# EasyEDA Pro project eLight_SD1006.eprj

# Schematic SCH
Create Date: 2023-01-14; Page Name: P1; Project Name: eLight_lite; Schematic Name: SCH; Update Date: 2023-02-21; Company: 嘉立创EDA; Page Size: A4; Version: V1.0
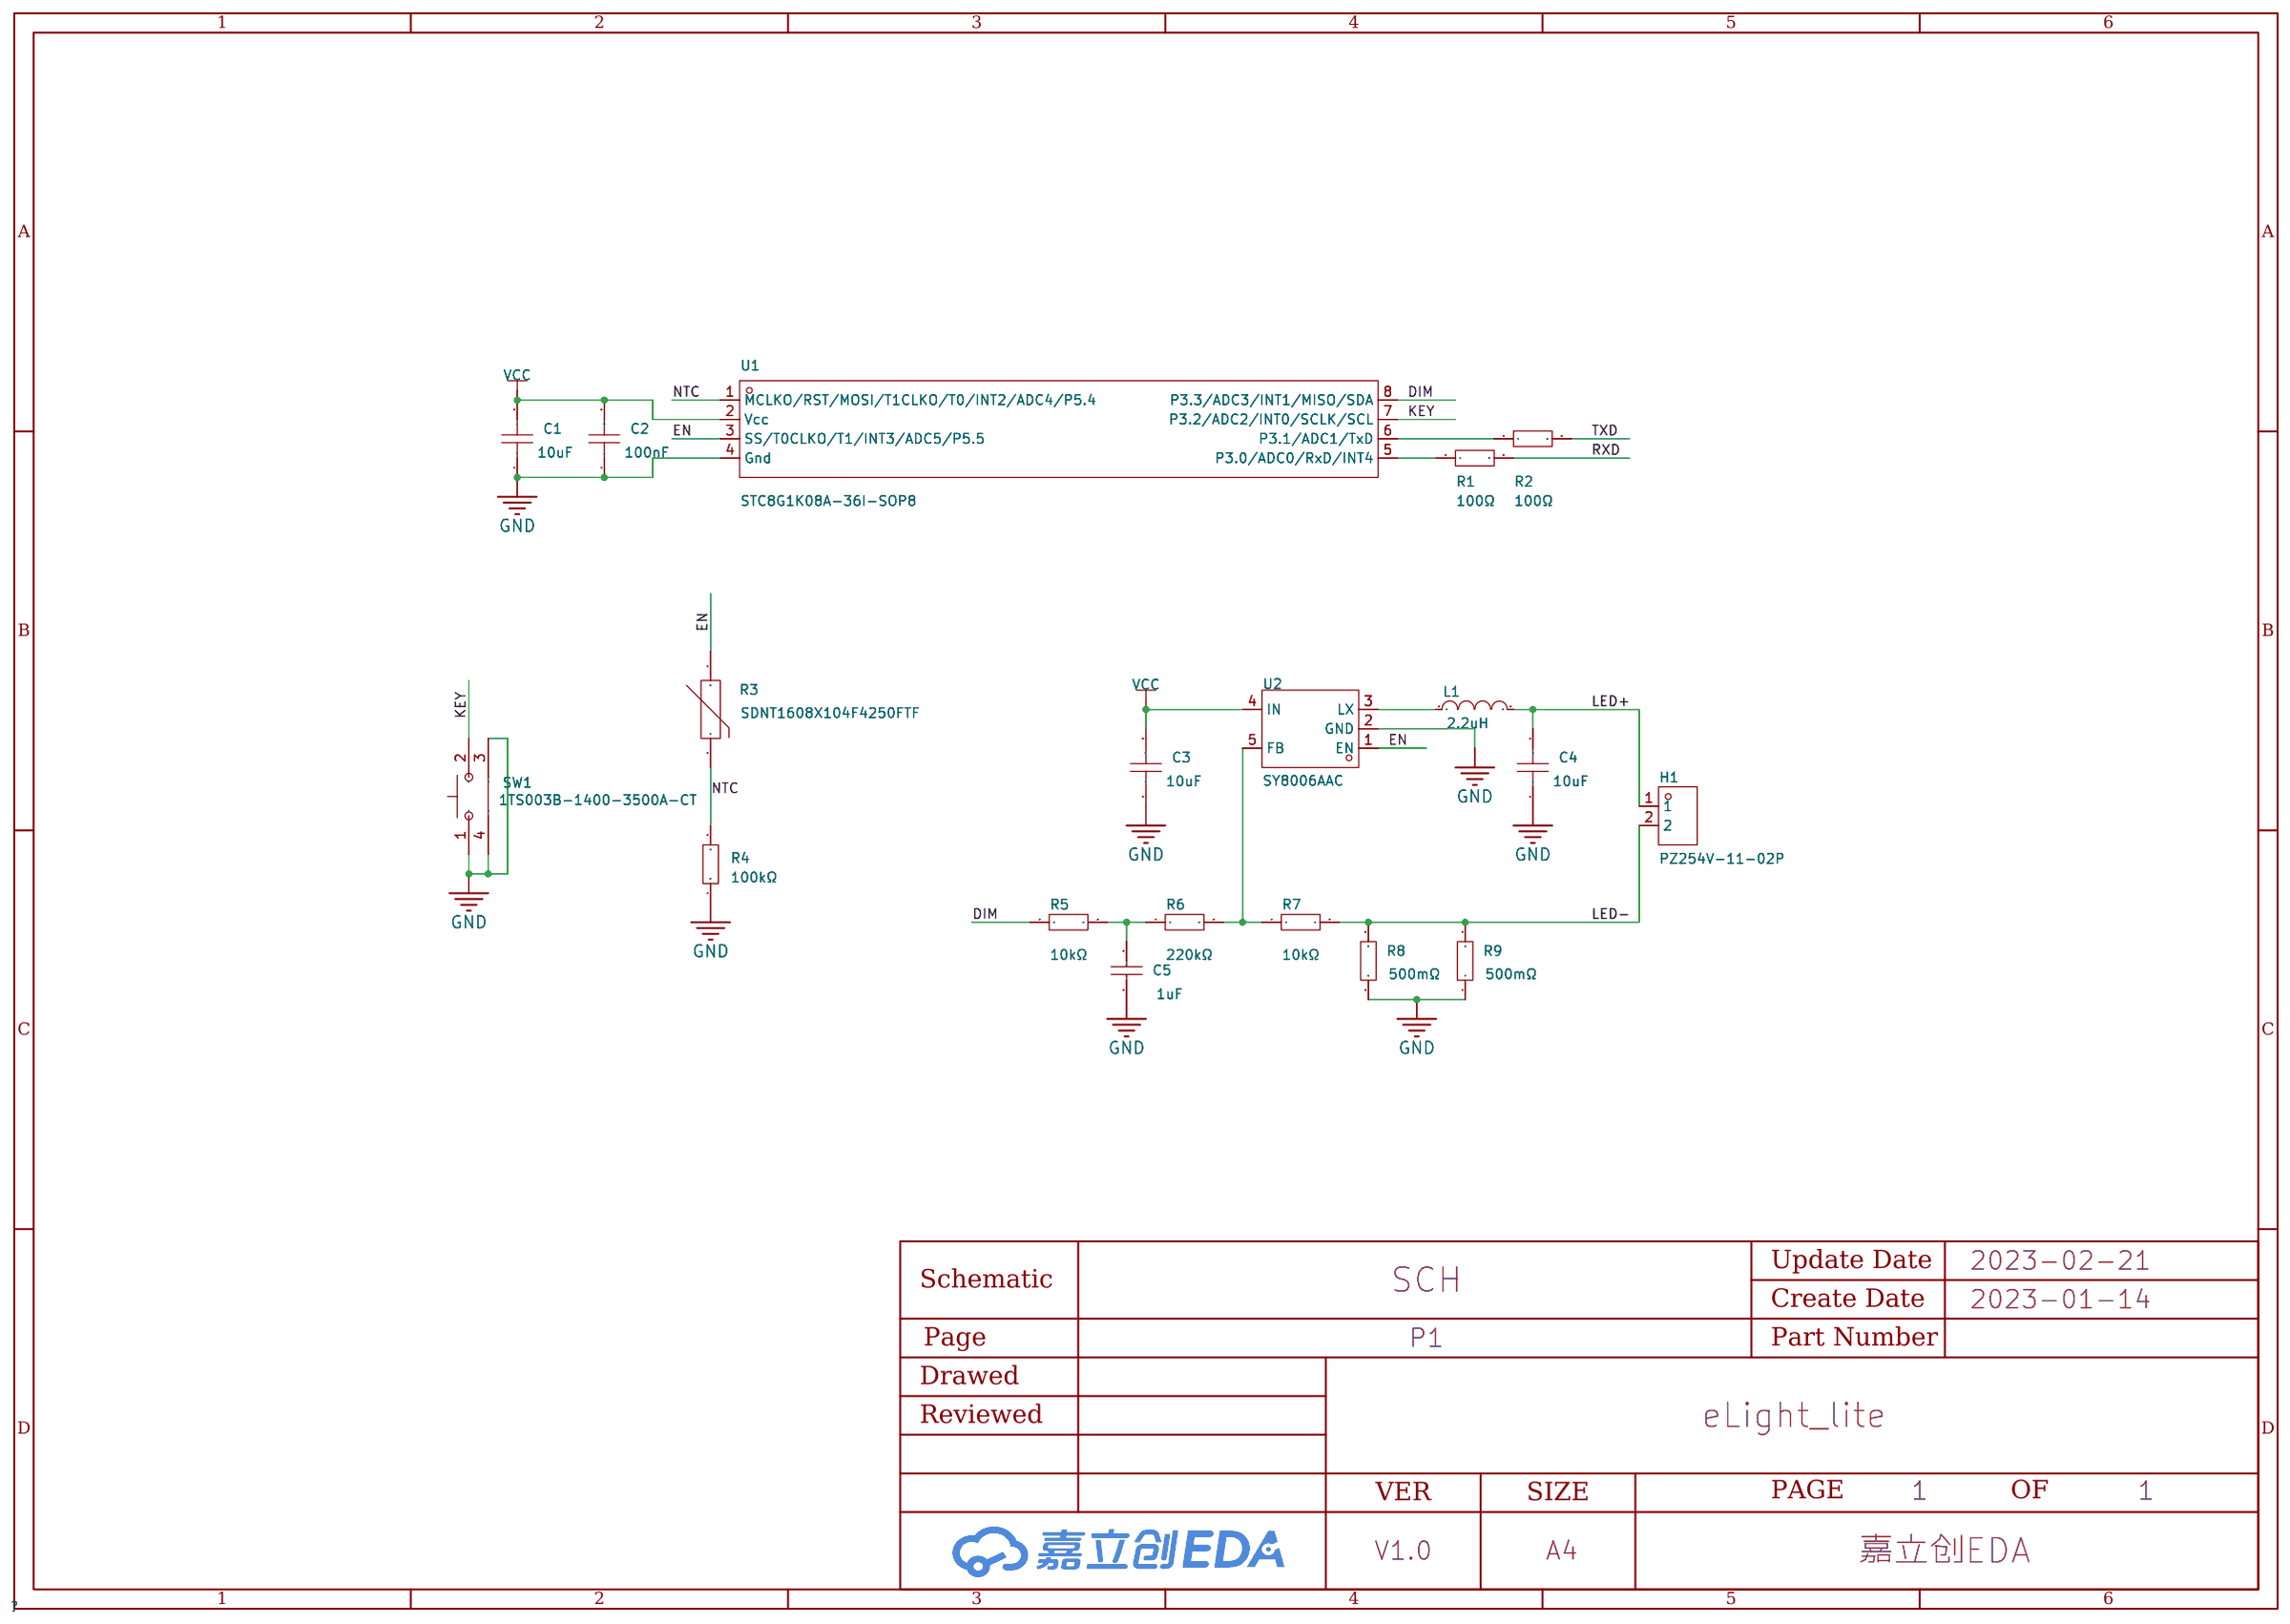
[diagram p0: schematic sheet]

## Parts
C1  10uF  [C0603]
C2  100nF  [C0603]
C3  10uF  [C0603]
C4  10uF  [C0603]
C5  1uF  [C0603]
H1  PZ254V-11-02P  [HDR-TH_2P-P2.54-V-M]  (no BOM)
L1  2.2uH  [IND-SMD_L4.0-W4.0]
R1  100Ω  [R0603]
R2  100Ω  [R0603]
R3  SDNT1608X104F4250FTF  [R0603]
R4  100kΩ  [R0603]
R5  10kΩ  [R0603]
R6  220kΩ  [R0603]
R7  10kΩ  [R0603]
R8  500mΩ  [R0805]
R9  500mΩ  [R0805]
SW1  1TS003B-1400-3500A-CT  [KEY-SMD_1TS003B]
U1  STC8G1K08A-36I-SOP8  [SOP-8_L5.0-W4.0-P1.27-LS6.0-BL]
U2  SY8006AAC  [SOT-23-5_L3.0-W1.6-P0.95-LS2.8-BR]

## Library data of the parts
C1 C3 C4 = CL10A106KP8NNNC: 容值:10uF;精度:±10%;额定电压:10V;材质(温度系数):X5R;; LCSC Part Name: 10uF ±10% 10V; Supplier Part: C19702; Manufacturer: SAMSUNG(三星); Supplier Footprint: 0603; JLCPCB Part Class: Basic Part; Datasheet: https://atta.szlcsc.com/upload/public/pdf/source/20160103/1457707703378.pdf; Supplier: LCSC; Tolerance: ±10%; Voltage Rated: 10V; Temperature Coefficient: X5R
C2 = CC0603KRX7R9BB104: 容值:100nF;精度:±10%;额定电压:50V;材质(温度系数):X7R;; LCSC Part Name: 100nF ±10% 50V; Supplier Part: C14663; Manufacturer: YAGEO(国巨); Supplier Footprint: 0603; JLCPCB Part Class: Basic Part; Datasheet: https://atta.szlcsc.com/upload/public/pdf/source/20170116/1484561234239.pdf; Supplier: LCSC; Tolerance: ±10%; Voltage Rated: 50V; Temperature Coefficient: X7R
C5 = CL10A105KB8NNNC: 容值:1uF;精度:±10%;额定电压:50V;材质(温度系数):X5R;; LCSC Part Name: 1uF ±10% 50V; Supplier Part: C15849; Manufacturer: SAMSUNG(三星); Supplier Footprint: 0603; JLCPCB Part Class: Basic Part; Datasheet: https://atta.szlcsc.com/upload/public/pdf/source/20160103/1457707679084.pdf; Supplier: LCSC; Tolerance: ±10%; Voltage Rated: 50V; Temperature Coefficient: X5R
H1 = PZ254V-11-02P: 排数:单排;总PIN位数:2;间距:2.54mm;插针结构:1x2P;行距:-;安装类型:直插;圆针/方针:方针;额定电流:-;额定电压:-;配合针长度:6mm;塑高:2.5mm;端接针长度:3mm;触头材质:黄铜;触头镀层:-;工作温度范围:-40℃~+105℃;颜色:黑色;; LCSC Part Name: 2.54mm 1x2P 直插 方针; Supplier Part: C492401; Manufacturer: XFCN(兴飞); Supplier Footprint: 直插,P=2.54mm; JLCPCB Part Class: Extended Part; Datasheet: https://atta.szlcsc.com/upload/public/pdf/source/20200309/C492401_A812433581A9B211A7FFA413ADDFF0E5.pdf; Supplier: LCSC; Number of Rows: 单排; Number of Pins: 2; Pitch: 2.54mm; Pin Structure: 1x2P; Mounting Type: 直插; Circluar Pins/Square Pins: 方针; Length of Mating Pin: 6mm; Insulation Height: 2.5mm; Length of End Connection Pin: 3mm; Contact Material: 黄铜; Operating Temperature Range: -40℃~+105℃; Color: 黑色
L1 = SWPA4020S2R2MT: 电感值:2.2uH;精度:±20%;额定电流:-;直流电阻(DCR):-;; LCSC Part Name: 2.2uH ±20%; Supplier Part: C83423; Manufacturer: Sunlord(顺络); Supplier Footprint: SMD; JLCPCB Part Class: Extended Part; Datasheet: https://atta.szlcsc.com/upload/public/pdf/source/20210916/AC798BA7E846B7D0B6818F45CD84DB0B.pdf; Supplier: LCSC; Tolerance: ±20%
R1 R2 = 0603WAF1000T5E: 电阻类型:厚膜电阻;阻值:100Ω;精度:±1%;功率:100mW;温度系数:±200ppm/℃;最大工作电压:75V;工作温度范围:-55℃~+155℃;; LCSC Part Name: 100Ω ±1% 100mW; Supplier Part: C22775; Manufacturer: UNI-ROYAL(厚声); Supplier Footprint: 0603; JLCPCB Part Class: Basic Part; Datasheet: https://atta.szlcsc.com/upload/public/pdf/source/20200306/C422600_1E6D84923E4A46A82E41ADD87F860B5C.pdf; Supplier: LCSC; Type: 厚膜电阻; Tolerance: ±1%; Power(Watts): 100mW; Temperature Coefficient: ±200ppm/℃; Overload Voltage (Max): 75V; Operating Temperature Range: -55℃~+155℃
R3 = SDNT1608X104F4250FTF: 阻值(25℃):100kΩ;电阻精度:±1%;B值精度:±1%;B值(25℃/50℃):4250K;功率:100mW;最大稳态电流(25℃):100uA;B值(25℃/75℃):-;B值(25℃/85℃):-;B值(25℃/100℃):-;工作温度:-55℃~+125℃;; LCSC Part Name: 100kΩ 电阻精度:±1% 4250K; Supplier Part: C95955; Manufacturer: Sunlord(顺络); Supplier Footprint: 0603; JLCPCB Part Class: Extended Part; Datasheet: https://atta.szlcsc.com/upload/public/pdf/source/20210916/BF106A3565EDFEB141CB3E0EA3A661F8.pdf; Supplier: LCSC; Resistance @ 25℃: 100kΩ; Resistance Tolerance: ±1%; B Constant Tolerance: ±1%; B Constant (25℃/50℃): 4250K; Power: 100mW; Steady State Current (Max): 100uA; Operating Temperature: -55℃~+125℃
R4 = 0603WAF1003T5E: 电阻类型:厚膜电阻;阻值:100kΩ;精度:±1%;功率:100mW;温度系数:±100ppm/℃;最大工作电压:75V;工作温度范围:-55℃~+155℃;; LCSC Part Name: 100kΩ ±1% 100mW; Supplier Part: C25803; Manufacturer: UNI-ROYAL(厚声); Supplier Footprint: 0603; JLCPCB Part Class: Basic Part; Datasheet: https://atta.szlcsc.com/upload/public/pdf/source/20200306/C422600_1E6D84923E4A46A82E41ADD87F860B5C.pdf; Supplier: LCSC; Type: 厚膜电阻; Tolerance: ±1%; Power(Watts): 100mW; Temperature Coefficient: ±100ppm/℃; Overload Voltage (Max): 75V; Operating Temperature Range: -55℃~+155℃
R5 R7 = 0603WAF1002T5E: 电阻类型:厚膜电阻;阻值:10kΩ;精度:±1%;功率:100mW;温度系数:±100ppm/℃;最大工作电压:75V;工作温度范围:-55℃~+155℃;; LCSC Part Name: 10kΩ ±1% 100mW; Supplier Part: C25804; Manufacturer: UNI-ROYAL(厚声); Supplier Footprint: 0603; JLCPCB Part Class: Basic Part; Datasheet: https://atta.szlcsc.com/upload/public/pdf/source/20200306/C422600_1E6D84923E4A46A82E41ADD87F860B5C.pdf; Supplier: LCSC; Type: 厚膜电阻; Tolerance: ±1%; Power(Watts): 100mW; Temperature Coefficient: ±100ppm/℃; Overload Voltage (Max): 75V; Operating Temperature Range: -55℃~+155℃
R6 = 0603WAF2203T5E: 电阻类型:厚膜电阻;阻值:220kΩ;精度:±1%;功率:100mW;温度系数:±100ppm/℃;最大工作电压:75V;工作温度范围:-55℃~+155℃;; LCSC Part Name: 220kΩ ±1% 100mW; Supplier Part: C22961; Manufacturer: UNI-ROYAL(厚声); Supplier Footprint: 0603; JLCPCB Part Class: Basic Part; Datasheet: https://atta.szlcsc.com/upload/public/pdf/source/20200306/C422600_1E6D84923E4A46A82E41ADD87F860B5C.pdf; Supplier: LCSC; Type: 厚膜电阻; Tolerance: ±1%; Power(Watts): 100mW; Temperature Coefficient: ±100ppm/℃; Overload Voltage (Max): 75V; Operating Temperature Range: -55℃~+155℃
R8 R9 = 0805W8F500LT5E: 电阻类型:厚膜电阻;阻值:500mΩ;精度:±1%;功率:125mW;温度系数:±800ppm/℃;最大工作电压:150V;工作温度范围:-55℃~+155℃;; LCSC Part Name: 500mΩ ±1% 125mW; Supplier Part: C28319; Manufacturer: UNI-ROYAL(厚声); Supplier Footprint: 0805; JLCPCB Part Class: Extended Part; Datasheet: https://atta.szlcsc.com/upload/public/pdf/source/20200306/C422600_1E6D84923E4A46A82E41ADD87F860B5C.pdf; Supplier: LCSC; Type: 厚膜电阻; Tolerance: ±1%; Power(Watts): 125mW; Temperature Coefficient: ±800ppm/℃; Overload Voltage (Max): 150V; Operating Temperature Range: -55℃~+155℃
SW1 = 1TS003B-1400-3500A-CT: 触点电流:50mA;额定电压(DC):12V;额定功率:0.6W;绝缘电阻:100MΩ;电路结构:单刀单掷;安装方式:卧贴;按钮形状:矩形按钮;按钮/盖帽颜色:黑色;带灯:无;作用力:140gf@±30gf;机械寿命:50000;工作温度:-40℃~+90℃;引脚样式:J型引脚;开关长度:4.6mm;开关宽度:1.82mm;开关高度:3.5mm;带支架:否;; LCSC Part Name: 半包带柱轻触开关 白色两个弹片  塑胶按钮; Supplier Part: C319392; Manufacturer: HYP(鸿源精密); Supplier Footprint: SMD,4.6x1.82mm; JLCPCB Part Class: Extended Part; Datasheet: https://atta.szlcsc.com/upload/public/pdf/source/20181106/C319392_EA06B27D310AC8B4E1BA9275A0C91ACF.pdf; Supplier: LCSC; Contact Current: 50mA; Voltage Rating (DC): 12V; Power Rating: 0.6W; Insulation Resistance: 100MΩ; Circuit: 单刀单掷; Mounting Style: 卧贴; Actuator Style: 矩形按钮; Actuator/Cap Color: 黑色; With Lamp: 无; Operating Force: 140gf@±30gf; Mechanical Life: 50000; Operating Temperature: -40℃~+90℃; Pin Style: J型引脚; Switch Length: 4.6mm; Switch Width: 1.82mm; Switch Height: 3.5mm; Strike Gundam: 否
U1 = STC8G1K08A-36I-SOP8: CPU内核:51系列;CPU最大主频:-;工作电压范围:1.9V~5.5V;内部振荡器:有;外部时钟频率范围:-;程序 FLASH容量:8KB;RAM总容量:1.25KB;EEPROM/数据 FLASH容量:4KB;GPIO端口数量:6;ADC(单元数/通道数/位数):1@x6ch/10bit;DAC(单元数/通道数/位数):-;(E)PWM(单元数/通道数/位数):-;8位Timer数量:-;16位Timer数量:2;32位Timer数量:-;内部比较器数量:-;U(S)ART路数:1;I2C路数:1;; LCSC Part Name: 51系列 闪存：8KB RAM：1.25KB; Supplier Part: C915663; Manufacturer: STC(宏晶); Supplier Footprint: SOP-8-4.0mm; JLCPCB Part Class: Extended Part; Datasheet: https://atta.szlcsc.com/upload/public/pdf/source/20201105/C713818_1666C7558605C197DBF08446D241F69F.pdf; Supplier: LCSC; CPU Core: 51系列; Supply Voltage Range: 1.9V~5.5V; Internal Oscillator: 有; Program FLASH Size: 8KB; RAM Size: 1.25KB; EEPROM/Data FLASH Size: 4KB; GPIO Ports Number: 6; ADC (Units/Channels/bits): 1@x6ch/10bit; 16Bit Timer Number: 2; U(S)ART Number: 1; I2C Number: 1; (Q)SPI Number: 1; Peripherals / Functions / Protocol Stacks: 低电压检测；看门狗；CCP捕获/比较；除法器；乘法器; Operating Temperature Range: -40℃~+85℃
U2 = SY8006AAC: Supplier Part: C207635; Manufacturer: silergy(矽力杰); Supplier Footprint: SOT-23-5; JLCPCB Part Class: Extended Part; Datasheet: https://atta.szlcsc.com/upload/public/pdf/source/20220426/6B77E4D9F50C5AD910D0E0C02879B237.pdf; Supplier: LCSC

## Nets
GND: C1.1 C2.1 C3.1 C4.1 C5.1 R4.1 R8.1 R9.1 SW1.1 SW1.3 SW1.4 U1.4(Gnd) U2.2(GND)
VCC: C1.2 C2.2 C3.2 U1.2(Vcc) U2.4(IN)
DIM: R5.1 U1.8(P3.3/ADC3/INT1/MISO/SDA)
EN: R3.2 U1.3(SS/T0CLKO/T1/INT3/ADC5/P5.5) U2.1(EN)
KEY: SW1.2 U1.7(P3.2/ADC2/INT0/SCLK/SCL)
LED+: C4.2 H1.1 L1.2
LED-: H1.2 R7.2 R8.2 R9.2
NTC: R3.1 R4.2 U1.1(MCLKO/RST/MOSI/T1CLKO/T0/INT2/ADC4/P5.4)
RXD: R1.2
TXD: R2.2
$1N3190: L1.1 U2.3(LX)
$1N3392: R6.2 R7.1 U2.5(FB)
$1N3897: C5.2 R5.2 R6.1
$1N6851: R2.1 U1.6(P3.1/ADC1/TxD)
$1N38229: R1.1 U1.5(P3.0/ADC0/RxD/INT4)

# Board PCB
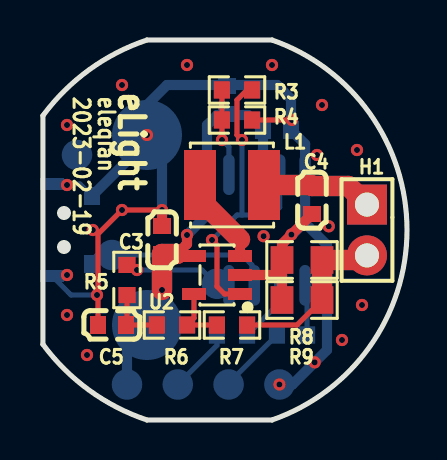
[diagram p1: board, top side]
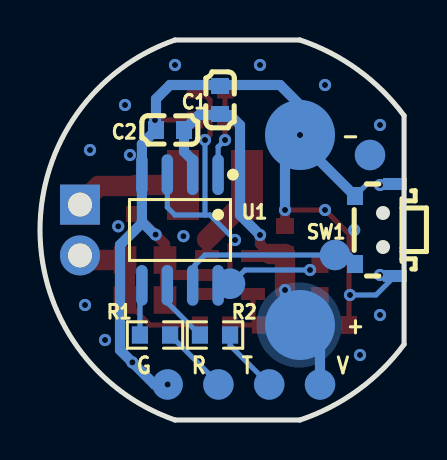
[diagram p2: board, bottom side, seen from below]

Outline 18.2 x 19 mm; copper layers: Top Layer, Bottom Layer. Coordinates in mm from the lower left corner of the outline.
Outline path: 0,15.22 0,3.78 arc(2.31,1.49) 5.2,0 11.45,0 arc(18.2,9.5) 11.45,19 5.2,19 arc(2.31,17.51) 0,15.22
Stack: Top Layer 0.035mm / Dielectric1 0.91mm FR4 er 4.5 / Bottom Layer 0.035mm

## Design rules (mm)
spacing safeClearance (default): track to track 0.152, other pairs 0.152 to 0.3
track width trackWidth (default): min 0.127, default 0.254, max 2.54
differential pair differentialPair (default): width min 0.127, default 0.254, max 2.54; gap min 0.152, default 0.152
via viaSize (default): diameter min 0.5, default 0.61, max 10; hole min 0.3, default 0.305, max 6
net GND uses copperRegion1
net LED+ uses copperRegion1

## Placement (name value [footprint] x y rotation side)
C1  10uF  [C0603]  9.2 16 270 bottom
C2  100nF  [C0603]  11.7 14.5 180 bottom
C3  10uF  [C0603]  5.95 9 270 top
C4  10uF  [C0603]  13.45 11 90 top
C5  1uF  [C0603]  3.45 4.75 0 top
H1  PZ254V-11-02P  [HDR-TH_2P-P2.54-V-M]  16.2 9.5 270 top
L1  2.2uH  [IND-SMD_L4.0-W4.0]  9.45 11.75 0 top
NOREF  -  [Pad_e884]  1.7 13.25 0 top
NOREF#2  -  [Pad_e113]  5.2 4.75 0 top
NOREF#3  -  [Pad_e864]  3.45 8.25 0 top
NOREF#4  -  [Pad_e664]  4.2 1.78 0 top
NOREF#5  -  [Pad_e946]  8.7 6.81 0 top
NOREF#6  -  [Pad_e115]  5.2 14.25 0 top
NOREF#7  -  [Pad_e663]  9.28 1.78 0 top
NOREF#8  -  [Pad_e660]  6.74 1.78 0 top
NOREF#9  -  [Pad_e2023]  11.82 1.78 0 top
R1  100Ω  [R0603]  12.45 4.25 180 bottom
R2  100Ω  [R0603]  9.45 4.25 180 bottom
R3  SDNT1608X104F4250FTF  [R0603]  9.7 16.5 0 top
R4  100kΩ  [R0603]  9.7 15 180 top
R5  10kΩ  [R0603]  4.2 7 270 top
R6  220kΩ  [R0603]  6.45 4.75 0 top
R7  10kΩ  [R0603]  9.45 4.75 0 top
R8  500mΩ  [R0805]  12.95 8 0 top
R9  500mΩ  [R0805]  12.95 6 0 top
SW1  1TS003B-1400-3500A-CT  [KEY-SMD_1TS003B]  1.45 9.5 90 bottom
U1  STC8G1K08A-36I-SOP8  [SOP-8_L5.0-W4.0-P1.27-LS6.0-BL]  11.2 9.5 0 bottom
U2  SY8006AAC  [SOT-23-5_L3.0-W1.6-P0.95-LS2.8-BR]  8.7 7.25 0 top

## Footprints (pads in the part's own frame, mm; a bottom-side part is the same pattern mirrored in y, then rotated)
C0603
  rect 0.8x0.9 smd: 1(-0.7,0) 2(0.7,0)
HDR-TH_2P-P2.54-V-M
  rect 2x2 hole 1.2: 1(-1.27,0)
  round 2 hole 1.2: 2(1.27,0)
IND-SMD_L4.0-W4.0
  rect 1.6x3.5 smd: 1(-1.6,0) 2(1.6,0)
KEY-SMD_1TS003B
  rect 0.9x0.8 smd: 1(1.7,1) 2(-1.7,1)
  rect 0.6x1.2 smd: 3(-2.3,-1) 4(2.3,-1)
Pad_e113
  round 3.5 smd far side: 1(0,0)
Pad_e115
  round 3.5 smd far side: 2(0,0)
Pad_e660
  round 1.524 smd far side: 1(0,0)
Pad_e663
  round 1.524 smd far side: 1(0,0)
Pad_e664
  round 1.524 smd far side: 1(0,0)
Pad_e864
  round 1.524 smd far side: 1(0,0)
Pad_e884
  round 1.524 smd far side: 1(0,0)
Pad_e946
  round 1.524 smd far side: 1(0,0)
Pad_e2023
  round 1.524 smd far side: 1(0,0)
R0603
  rect 0.806x0.864 smd: 1(-0.753,0) 2(0.753,0)
R0805
  rect 1.133x1.377 smd: 1(-1,0) 2(1,0)
SOP-8_L5.0-W4.0-P1.27-LS6.0-BL
  oval 0.574x2.035 smd: 1(-1.905,-2.768) 2(-0.635,-2.768) 3(0.635,-2.768) 4(1.905,-2.768) 5(1.905,2.768) 6(0.635,2.768) 7(-0.635,2.768) 8(-1.905,2.768)
SOT-23-5_L3.0-W1.6-P0.95-LS2.8-BR
  rect 1.2x0.6 smd: 1(1.15,-0.95) 2(1.15,0) 3(1.15,0.95) 4(-1.15,0.95) 5(-1.15,-0.95)

## Nets
GND: C1.1 C2.1 C3.1 C4.1 C5.1 NOREF.1 NOREF#6.2 NOREF#9.1 R4.1 R8.1 R9.1 SW1.1 SW1.3 SW1.4 U1.4 U2.2
VCC: C1.2 C2.2 C3.2 NOREF#2.1 NOREF#4.1 U1.2 U2.4
DIM: NOREF#5.1 R5.1 U1.8
EN: R3.2 U1.3 U2.1
KEY: NOREF#3.1 SW1.2 U1.7
LED+: C4.2 H1.1 L1.2
LED-: H1.2 R7.2 R8.2 R9.2
NTC: R3.1 R4.2 U1.1
RXD: NOREF#7.1 R1.2
TXD: NOREF#8.1 R2.2
$1N3190: L1.1 U2.3
$1N3392: R6.2 R7.1 U2.5
$1N3897: C5.2 R5.2 R6.1
$1N6851: R2.1 U1.6
$1N38229: R1.1 U1.5

## Via types
v1: diameter 0.61, hole 0.305, Top Layer to Bottom Layer, 30 vias

## Routing (per net, layer and track width the routed paths; a pad name or vN(x,y) marks a point on that pad's centre or on a via; arc(x,y) is an arc through that point)
GND: length 58
  Top Layer w0.254: v1(2.7,6.25) 2.75,6.25 ; v1(12.45,15) R4.1 ; C5.1 2.75,9.3 v1(3.95,10.5) v1(5.95,10.5)
  Top Layer w0.508: U2.2 11.93,7.25 11.95,7.22 ; C4.1 v1(12.42,9.27) 11.95,8.8 R8.1 11.95,7.22 ; C3.1 v1(5.95,10.5) ; 11.95,7.22 R9.1
  Bottom Layer w0.254: SW1.4 1.85,11.8 SW1.1 ; v1(2.7,6.25) 1.4,6.25 SW1.3
  Bottom Layer w0.508: 13.11,9.91 U1.4 13.11,13.8 C2.1 12.4,16.05 11.7,16.75 6.2,16.75 5.2,15.75 v1(5.2,14.25) ; 13.11,9.91 13.11,9.84 14.2,8.75 14.2,3.5 v1(13.59,2.88) 12.48,1.78 v1(11.82,1.78) ; 13.11,9.91 12.45,9.25 12.44,9.25 v1(12.42,9.27) ; v1(5.95,10.5) 5.95,13.5 v1(5.2,14.25) ; SW1.1 5.2,13.95 v1(5.2,14.25)
  vias: v1(1.2,14.75) v1(1.2,11.75) v1(1.2,7.25) v1(1.2,5.25) v1(2.2,3.25) v1(2.49,9.5) v1(3.95,16.75) v1(7.2,17.75) v1(11.03,9.19) v1(11.45,17.75) v1(13.7,13.25) v1(13.95,15.75) v1(14.29,9.69) v1(14.95,4) v1(15.7,13.5) v1(15.95,5.75)
VCC: length 21.7
  Top Layer w0.508: v1(7.2,9.25) 7.2,8.8 6.7,8.3 6.7,8.2 U2.4
  Top Layer w1.016: v1(5.95,6.5) C3.2 6.7,8.3
  Bottom Layer w0.508: v1(7.2,9.25) 8.2,10.25 8.2,14.74 8.71,15.25 10.25,15.25 C2.2 11,13.42 10.57,12.99 10.57,12.27 ; NOREF#4.1 4.2,3.75 NOREF#2.1 5.95,5.5 v1(5.95,6.5)
DIM: length 5.5
  Top Layer w0.254: R5.1 4.2,7.75 4.45,7.5 v1(4.7,7.5)
  Bottom Layer w0.254: v1(4.7,7.5) 7.95,7.5 8.72,6.73 U1.8
EN: length 16.2
  Top Layer w0.254: R3.2 10.2,16.5 9.7,16 9.7,14.25 v1(9.95,14) ; v1(8.45,9) 8.7,8.75 8.7,6.67 9.08,6.3 U2.1
  Bottom Layer w0.254: v1(8.45,9) 9.7,10.25 9.95,10.25 ; 9.95,10.25 11.45,10.25 11.84,10.64 U1.3 ; 9.95,10.25 v1(9.95,14)
KEY: length 9.6
  Bottom Layer w0.254: SW1.2 2.45,8 2.71,8.25 9.95,8.25 10.45,7.75 10.45,6.85 10.57,6.73
LED+: length 5.6
  Top Layer w1.016: L1.2 13.4,11.75 C4.2 15.27,11.7 H1.1
LED-: length 8.6
  Top Layer w0.254: R9.2 12.7,4.75 R7.2
  Top Layer w1.016: R9.2 R8.2 15.97,8 H1.2
NTC: length 4.4
  Top Layer w0.254: R3.1 R4.2 8.95,15 8.95,14.99 v1(8.95,14)
  Bottom Layer w0.254: U1.1 9.3,13.66 v1(8.95,14)
RXD: length 3.5
  Bottom Layer w0.254: NOREF#7.1 9.28,1.83 R1.2
TXD: length 3.3
  Bottom Layer w0.254: NOREF#8.1 8.7,3.73 R2.2
$1N3190: length 4.4
  Top Layer w0.508: U2.3 9.85,9.03
  Top Layer w1.016: L1.1 7.85,11.03 9.85,9.03
$1N3392: length 3.2
  Top Layer w0.254: U2.5 7.55,5.1 R6.2 R7.1
$1N3897: length 3.1
  Top Layer w0.254: R6.1 C5.2 4.2,4.8 R5.2
$1N6851: length 3.2
  Bottom Layer w0.254: R2.1 11.84,5.88 U1.6
$1N38229: length 2.5
  Bottom Layer w0.254: U1.5 13.21,6.63 R1.1

## Copper pours and planes (outline as drawn; the poured copper is in the pictures)
GND on Top Layer: 18.2,9.8 18.16,10.4 18.09,11 17.98,11.6 17.84,12.19 17.66,12.76 17.44,13.33 17.19,13.88 16.91,14.41 16.6,14.93 16.26,15.43 15.89,15.9 15.49,16.35 15.06,16.78 14.61,17.18 14.13,17.55 13.63,17.9 13.12,18.21 12.58,18.49 12.03,18.74 11.47,18.95 10.89,19.13 10.3,19.28 9.71,19.39 9.11,19.46 8.51,19.5 7.9,19.5 7.3,19.46 6.7,19.39 6.11,19.28 5.52,19.13 4.94,18.95 4.38,18.74 3.83,18.49 3.29,18.21 2.77,17.9 2.28,17.55 1.8,17.18 1.35,16.78 0.92,16.35 0.52,15.9 0.15,15.43 -0.19,14.93 -0.51,14.41 -0.79,13.88 -1.03,13.33 -1.25,12.76 -1.43,12.19 -1.57,11.6 -1.68,11 -1.75,10.4 -1.79,9.8 -1.79,9.2 -1.75,8.6 -1.68,8 -1.57,7.4 -1.43,6.81 -1.25,6.24 -1.03,5.67 -0.79,5.12 -0.51,4.59 -0.19,4.07 0.15,3.57 0.52,3.1 0.92,2.65 1.35,2.22 1.8,1.82 2.28,1.45 2.77,1.1 3.29,0.79 3.83,0.51 4.38,0.26 4.94,0.05 5.52,-0.13 6.11,-0.28 6.7,-0.39 7.3,-0.46 7.9,-0.5 8.51,-0.5 9.11,-0.46 9.71,-0.39 10.3,-0.28 10.89,-0.13 11.47,0.05 12.03,0.26 12.58,0.51 13.12,0.79 13.63,1.1 14.13,1.45 14.61,1.82 15.06,2.22 15.49,2.65 15.89,3.1 16.26,3.57 16.6,4.07 16.91,4.59 17.19,5.12 17.44,5.67 17.66,6.24 17.84,6.81 17.98,7.4 18.09,8 18.16,8.6 18.2,9.2
GND on Bottom Layer: 18.2,9.8 18.16,10.4 18.09,11 17.98,11.6 17.84,12.19 17.66,12.76 17.44,13.33 17.19,13.88 16.91,14.41 16.6,14.93 16.26,15.43 15.89,15.9 15.49,16.35 15.06,16.78 14.61,17.18 14.13,17.55 13.63,17.9 13.12,18.21 12.58,18.49 12.03,18.74 11.47,18.95 10.89,19.13 10.3,19.28 9.71,19.39 9.11,19.46 8.51,19.5 7.9,19.5 7.3,19.46 6.7,19.39 6.11,19.28 5.52,19.13 4.94,18.95 4.38,18.74 3.83,18.49 3.29,18.21 2.77,17.9 2.28,17.55 1.8,17.18 1.35,16.78 0.92,16.35 0.52,15.9 0.15,15.43 -0.19,14.93 -0.51,14.41 -0.79,13.88 -1.03,13.33 -1.25,12.76 -1.43,12.19 -1.57,11.6 -1.68,11 -1.75,10.4 -1.79,9.8 -1.79,9.2 -1.75,8.6 -1.68,8 -1.57,7.4 -1.43,6.81 -1.25,6.24 -1.03,5.67 -0.79,5.12 -0.51,4.59 -0.19,4.07 0.15,3.57 0.52,3.1 0.92,2.65 1.35,2.22 1.8,1.82 2.28,1.45 2.77,1.1 3.29,0.79 3.83,0.51 4.38,0.26 4.94,0.05 5.52,-0.13 6.11,-0.28 6.7,-0.39 7.3,-0.46 7.9,-0.5 8.51,-0.5 9.11,-0.46 9.71,-0.39 10.3,-0.28 10.89,-0.13 11.47,0.05 12.03,0.26 12.58,0.51 13.12,0.79 13.63,1.1 14.13,1.45 14.61,1.82 15.06,2.22 15.49,2.65 15.89,3.1 16.26,3.57 16.6,4.07 16.91,4.59 17.19,5.12 17.44,5.67 17.66,6.24 17.84,6.81 17.98,7.4 18.09,8 18.16,8.6 18.2,9.2
VCC on Bottom Layer: 3.13,6.88 7.38,6.88 7.38,2.62 3.13,2.62

## Text on the board
Bottom Silkscreen Layer: + | - | V | T | R | G
Top Silkscreen Layer: 2023-02-19 | eleqian | eLight
